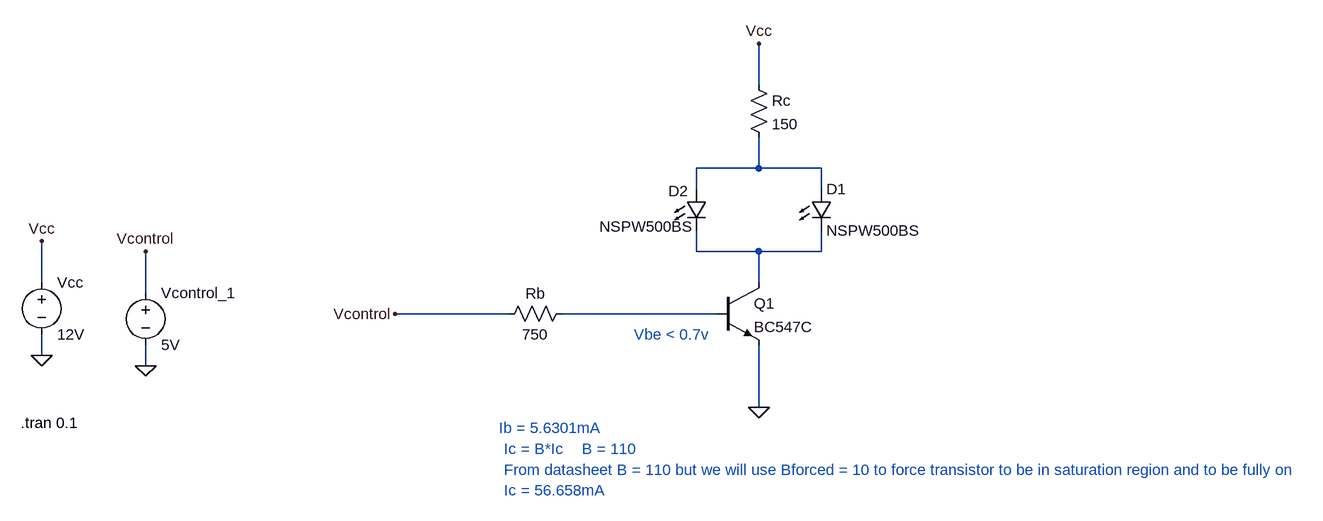
[diagram p0: schematic Design A Transistor.asc]
Design A Transistor.asc, the LTspice schematic file:
Version 4.1
SHEET 1 3268 680
WIRE 400 -160 400 -224
WIRE 400 -32 400 -80
WIRE 400 -32 304 -32
WIRE 496 -32 400 -32
WIRE 304 0 304 -32
WIRE 496 0 496 -32
WIRE 304 96 304 64
WIRE 400 96 304 96
WIRE 496 96 496 64
WIRE 496 96 400 96
WIRE -704 144 -704 80
WIRE 400 144 400 96
WIRE -544 160 -544 96
WIRE 16 192 -160 192
WIRE 336 192 96 192
WIRE -704 256 -704 224
WIRE -544 272 -544 240
WIRE 400 336 400 240
FLAG 400 336 0
FLAG -160 192 Vcontrol
FLAG 400 -224 Vcc
FLAG -704 256 0
FLAG -704 80 Vcc
FLAG -544 272 0
FLAG -544 96 Vcontrol
DATAFLAG -64 192 ""
DATAFLAG 256 192 ""
DATAFLAG 400 272 ""
SYMBOL npn 336 144 R0
SYMATTR InstName Q1
SYMATTR Value BC547C
SYMBOL res 384 -176 R0
SYMATTR InstName Rc
SYMATTR Value 150
SYMBOL res 112 176 R90
WINDOW 0 0 56 VBottom 2
WINDOW 3 32 56 VTop 2
SYMATTR InstName Rb
SYMATTR Value 750
SYMBOL voltage -704 128 R0
SYMATTR InstName Vcc
SYMATTR Value 12V
SYMBOL voltage -544 144 R0
WINDOW 123 0 0 Left 0
WINDOW 39 0 0 Left 0
SYMATTR InstName Vcontrol_1
SYMATTR Value 5V
SYMBOL LED 480 0 R0
SYMATTR InstName D1
SYMATTR Value NSPW500BS
SYMBOL LED 288 0 R0
WINDOW 0 -27 3 Left 2
WINDOW 3 -133 58 Left 2
SYMATTR InstName D2
SYMATTR Value NSPW500BS
TEXT -736 360 Left 2 !.tran 0.1
TEXT 208 224 Left 2 ;Vbe < 0.7v
TEXT 0 368 Left 2 ;Ib = 5.6301mA
TEXT 8 400 Left 2 ;Ic = B*Ic
TEXT 8 464 Left 2 ;Ic = 56.658mA
TEXT 128 400 Left 2 ;B = 110
TEXT 8 432 Left 2 ;From datasheet B = 110 but we will use Bforced = 10 to force transistor to be in saturation region and to be fully on

The netlist it stands for:
* Design A Transistor.asc
Q1 N002 N003 0 0 BC547C
Rc Vcc N001 150
Rb N003 Vcontrol 750
Vcc Vcc 0 12V
Vcontrol_1 Vcontrol 0 5V
D1 N001 N002 NSPW500BS
D2 N001 N002 NSPW500BS
.model D D
.lib standard.dio
.model NPN NPN
.model PNP PNP
.lib standard.bjt
.tran 0.1
* Vbe < 0.7v
* Ib = 5.6301mA
* Ic = B*Ic
* Ic = 56.658mA
* B = 110
* From datasheet B = 110 but we will use Bforced = 10 to force transistor to be in saturation region and to be fully on
.backanno
.end